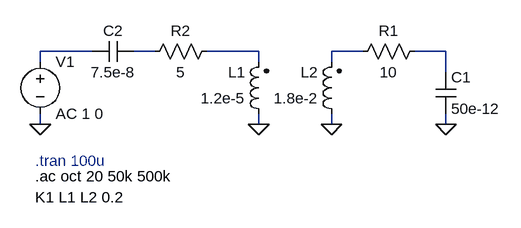
[diagram p0: schematic spice_model.asc]
spice_model.asc, the LTspice schematic file:
Version 4
SHEET 1 880 680
WIRE 96 240 16 240
WIRE 192 240 160 240
WIRE 352 240 272 240
WIRE 512 240 464 240
WIRE 640 240 592 240
WIRE 16 256 16 240
WIRE 352 256 352 240
WIRE 464 256 464 240
WIRE 640 272 640 240
WIRE 16 352 16 336
WIRE 352 352 352 336
WIRE 464 352 464 336
WIRE 640 352 640 336
FLAG 352 352 0
FLAG 464 352 0
FLAG 640 352 0
FLAG 16 352 0
SYMBOL ind2 368 352 R180
WINDOW 0 36 80 Left 2
WINDOW 3 36 40 Left 2
SYMATTR InstName L1
SYMATTR Value 1.2e-5
SYMBOL ind2 480 352 R180
WINDOW 0 36 80 Left 2
WINDOW 3 36 40 Left 2
SYMATTR InstName L2
SYMATTR Value 1.8e-2
SYMBOL cap 624 272 R0
SYMATTR InstName C1
SYMATTR Value 50e-12
SYMBOL Res 608 224 R90
WINDOW 0 0 56 VBottom 2
WINDOW 3 32 56 VTop 2
SYMATTR InstName R1
SYMATTR Value 10
SYMBOL Res 288 224 R90
WINDOW 0 0 56 VBottom 2
WINDOW 3 32 56 VTop 2
SYMATTR InstName R2
SYMATTR Value 5
SYMBOL cap 160 224 R90
WINDOW 0 0 32 VBottom 2
WINDOW 3 32 32 VTop 2
SYMATTR InstName C2
SYMATTR Value 7.5e-8
SYMBOL voltage 16 240 R0
SYMATTR InstName V1
SYMATTR Value AC 1 0
SYMATTR Value2 AC 1 0
TEXT 8 432 Left 2 !.ac oct 20 50k 500k
TEXT 8 464 Left 2 !K1 L1 L2 0.2
TEXT 8 408 Left 2 ;.tran 100u

The netlist it stands for:
* spice_model.asc
L1 0 N003 1.2e-5
L2 0 N004 1.8e-2
C1 N005 0 50e-12
R1 N005 N004 10
R2 N003 N002 5
C2 N002 N001 7.5e-8
V1 N001 0 AC 1 0 AC 1 0
.ac oct 20 50k 500k
K1 L1 L2 0.2
* .tran 100u
.backanno
.end